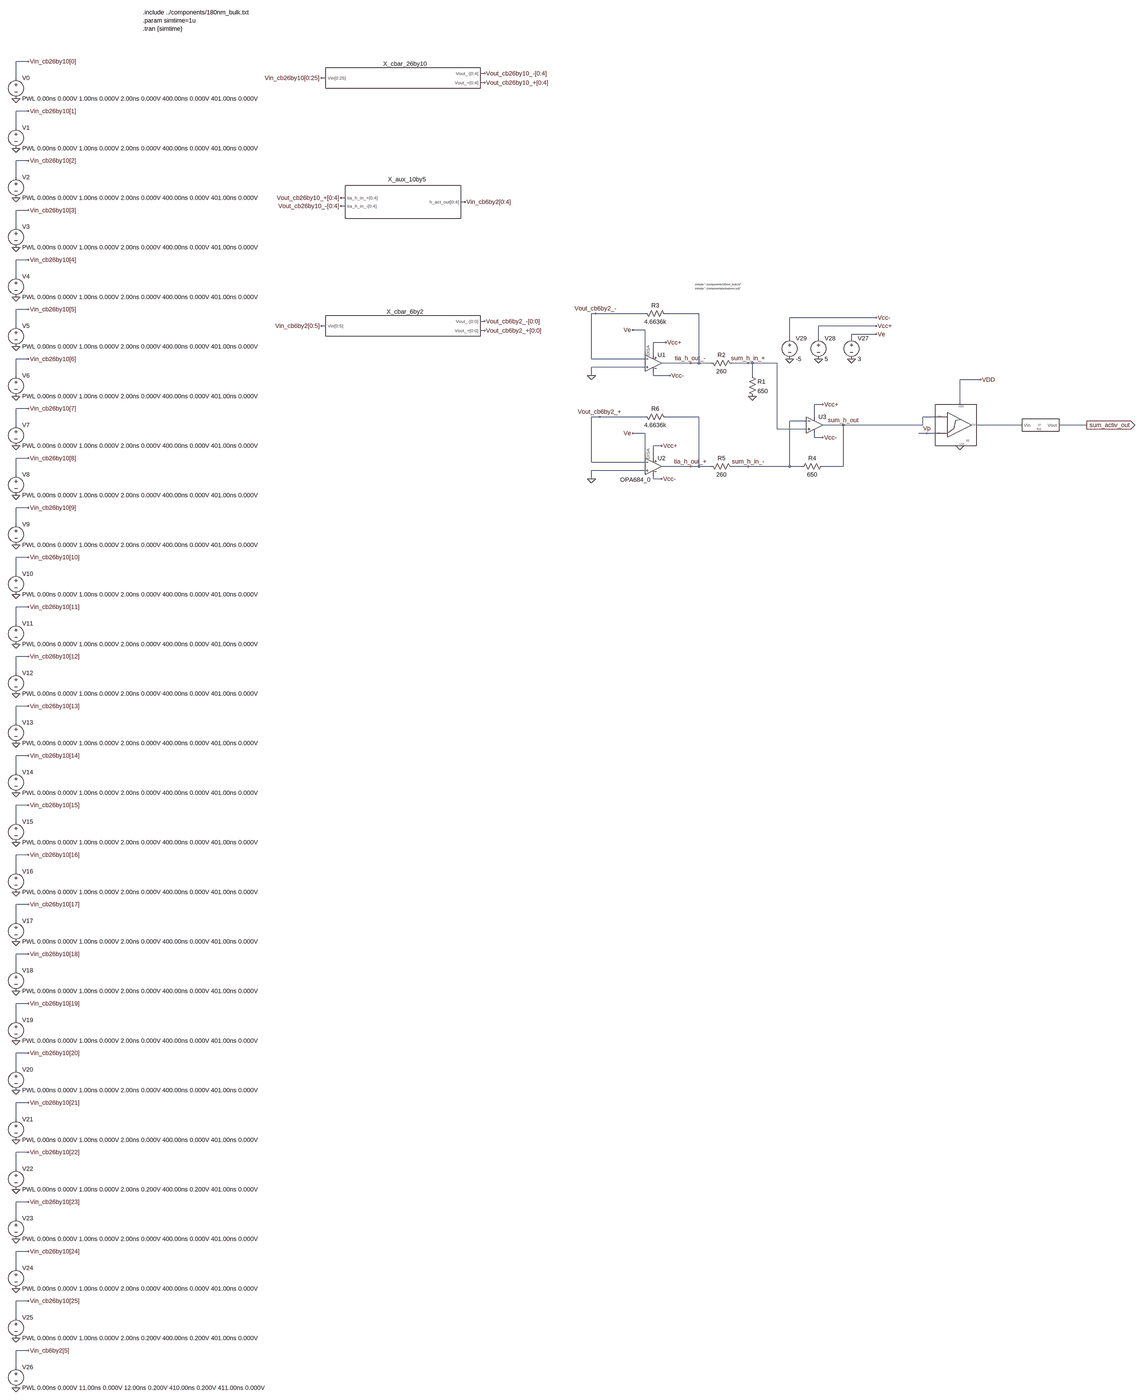
[diagram p0: schematic complete_circuit_generated.asc, whole sheet]
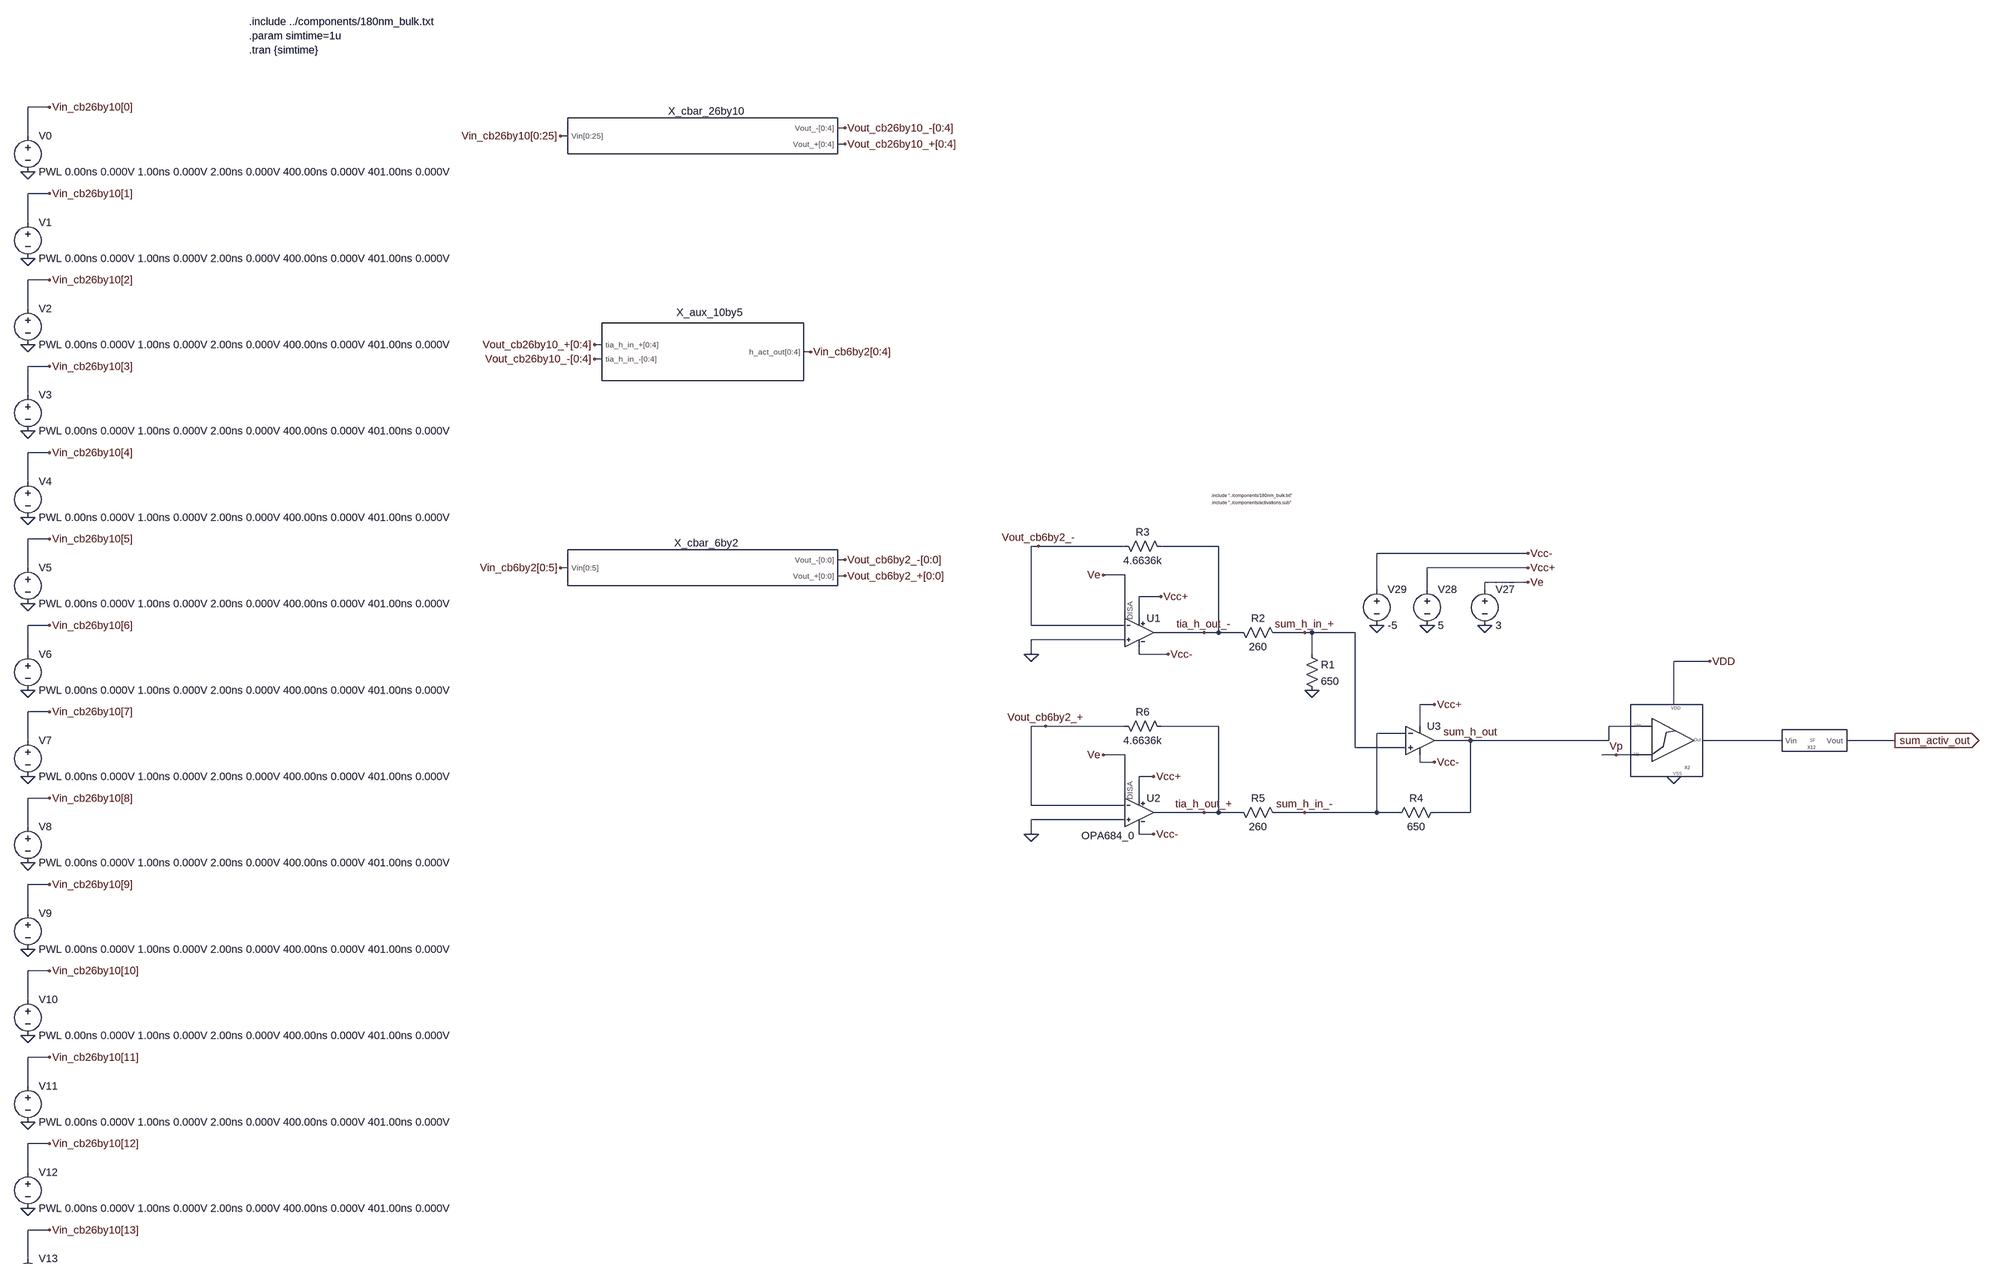
[diagram p1: schematic complete_circuit_generated.asc, part, row 1 of 2, column 1 of 1]
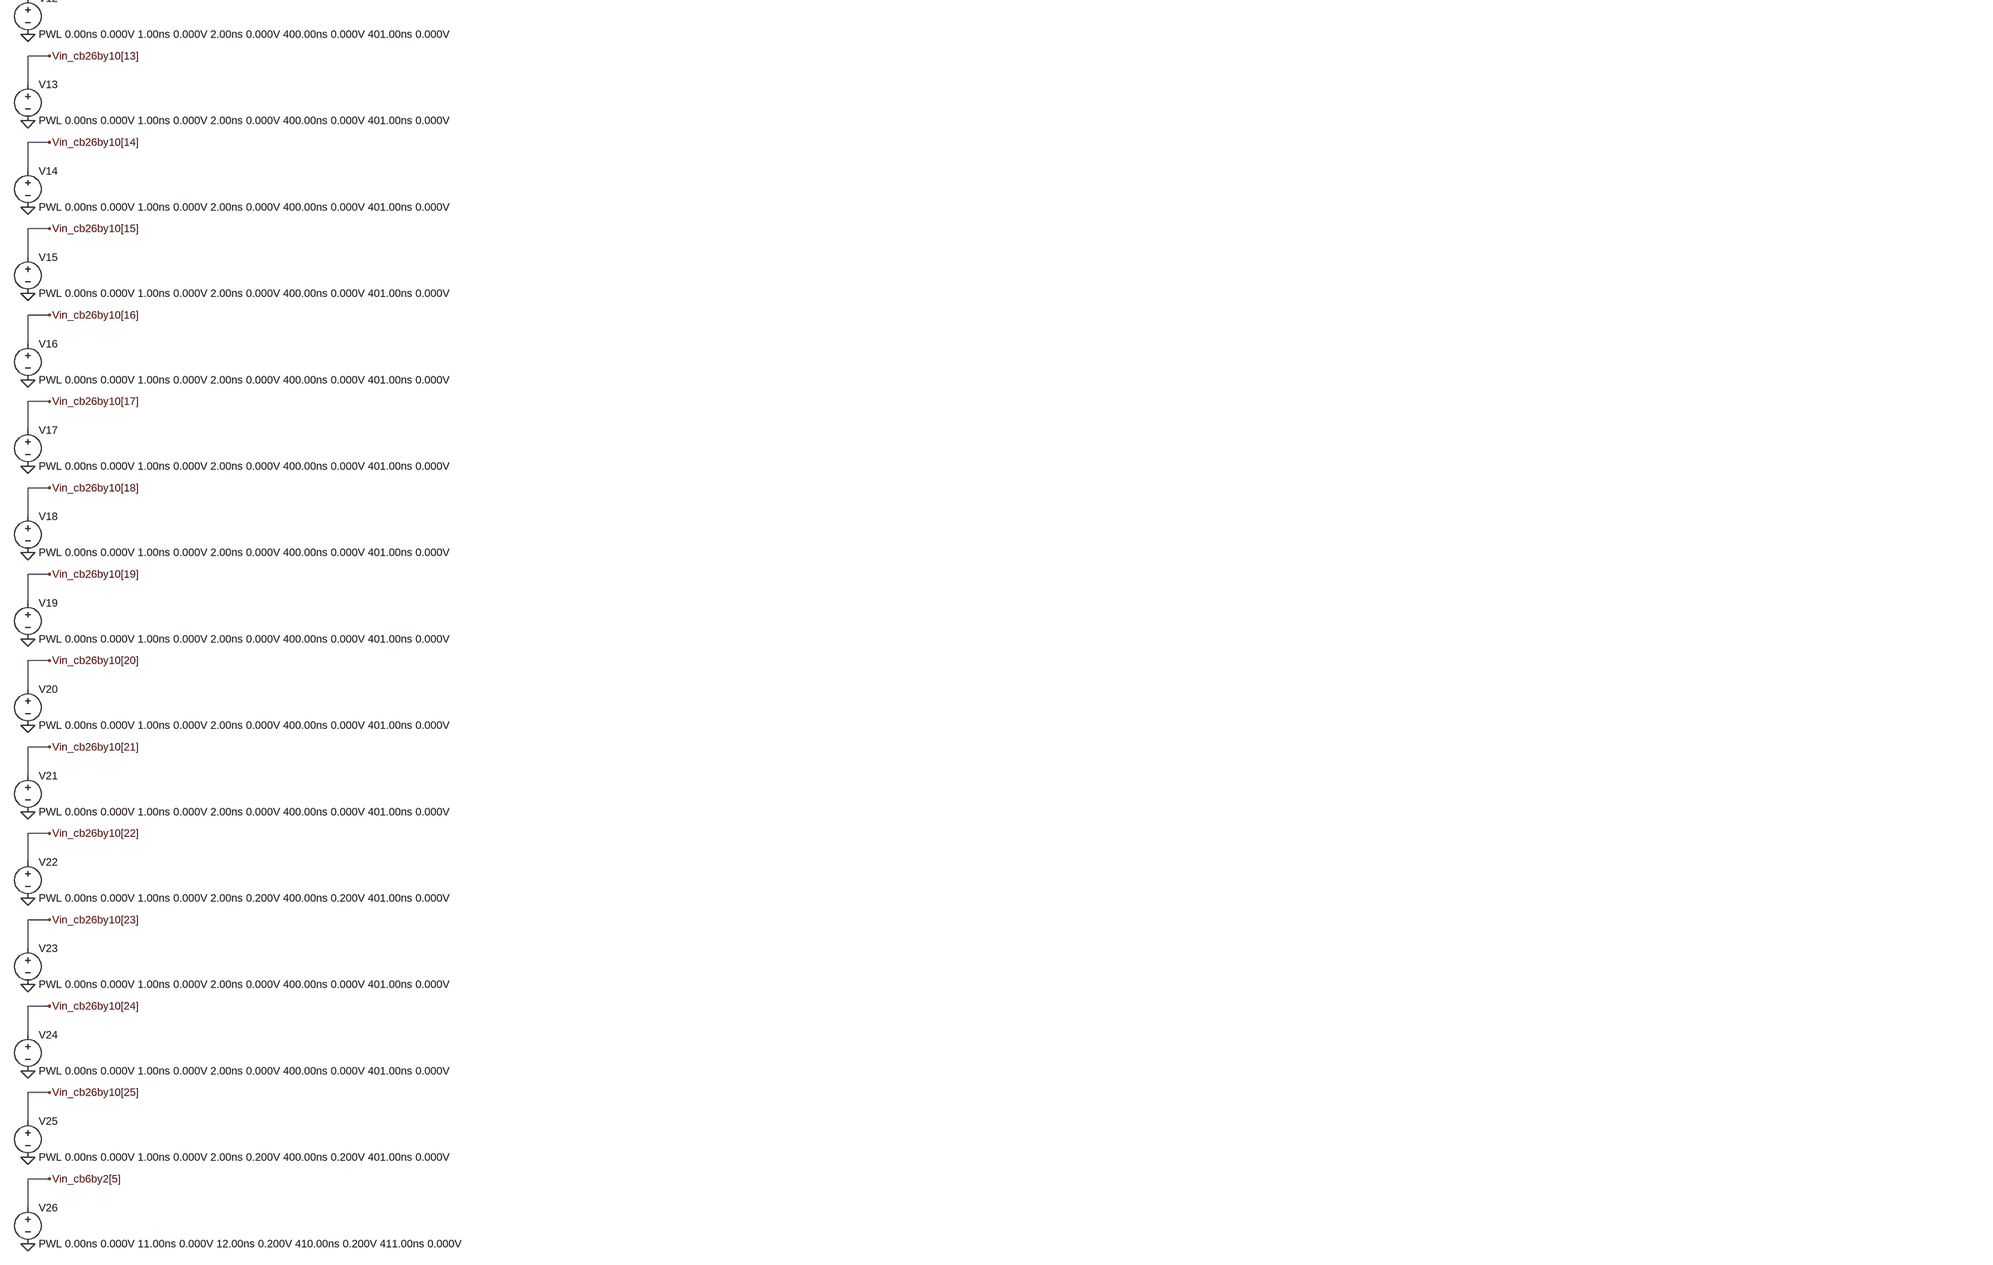
[diagram p2: schematic complete_circuit_generated.asc, part, row 2 of 2, column 1 of 1]
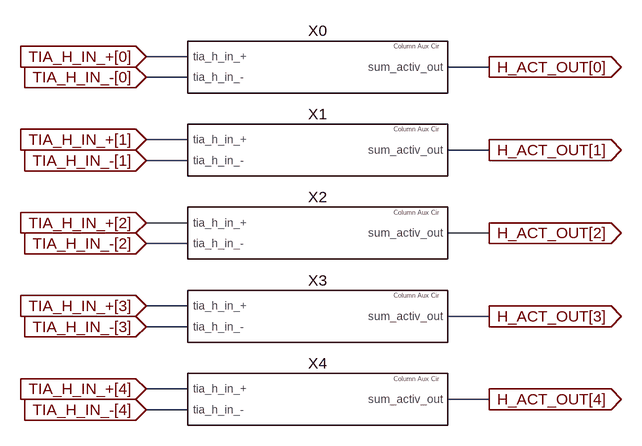
[diagram p3: sub-circuit x_aux_10by5.asc]
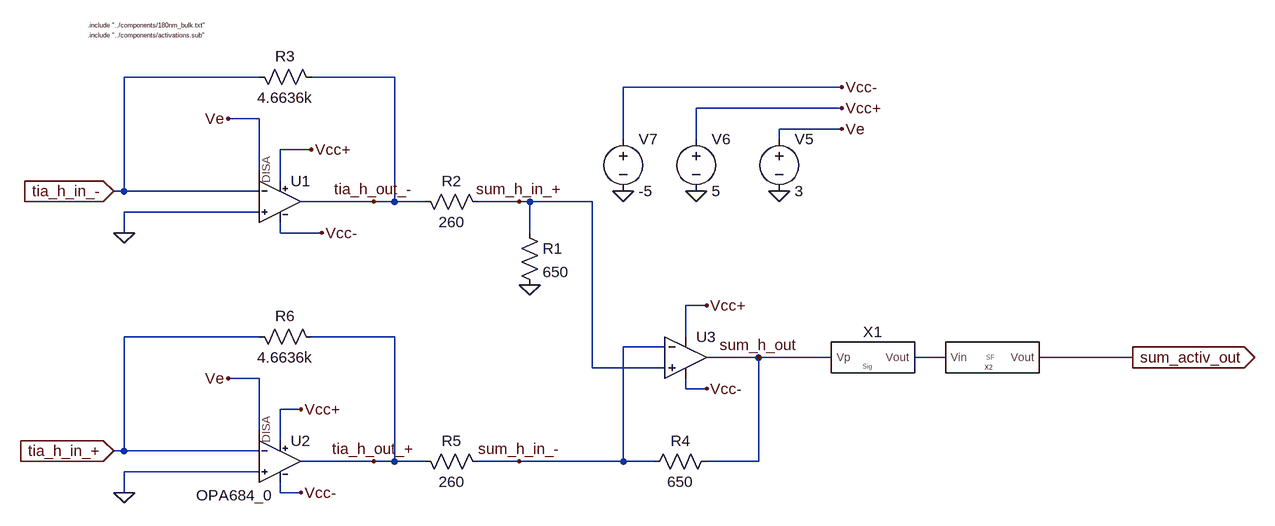
[diagram p4: sub-circuit column_activ_cmos.asc]
complete_circuit_generated.asc, the LTspice schematic file:
Version 4
SHEET 1 3496 5212
WIRE -1452 -48 -1500 -48
WIRE 316 -2 300 -2
WIRE -1500 16 -1500 -48
WIRE -300 16 -316 16
WIRE 316 34 300 34
WIRE -1452 144 -1500 144
WIRE -1500 208 -1500 144
WIRE -1452 336 -1500 336
WIRE -1500 400 -1500 336
WIRE -224 480 -240 480
WIRE 240 496 224 496
WIRE -224 512 -240 512
WIRE -1452 528 -1500 528
WIRE -1500 592 -1500 528
WIRE -1452 720 -1500 720
WIRE -1500 784 -1500 720
WIRE -1452 912 -1500 912
WIRE 1008 928 992 928
WIRE 1200 928 1008 928
WIRE 1408 928 1280 928
WIRE 2096 944 1760 944
WIRE 316 958 300 958
WIRE -1500 976 -1500 912
WIRE -300 976 -316 976
WIRE 2096 976 1872 976
WIRE 1200 992 1152 992
WIRE 316 994 300 994
WIRE 2096 1008 2000 1008
WIRE 1760 1024 1760 944
WIRE 1872 1024 1872 976
WIRE 2000 1024 2000 1008
WIRE 1280 1040 1232 1040
WIRE 1200 1072 1200 992
WIRE 1232 1088 1232 1040
WIRE -1452 1104 -1500 1104
WIRE 992 1104 992 928
WIRE 1200 1104 992 1104
WIRE 1376 1120 1264 1120
WIRE 1408 1120 1408 928
WIRE 1408 1120 1376 1120
WIRE 1456 1120 1408 1120
WIRE 1600 1120 1536 1120
WIRE 1616 1120 1600 1120
WIRE 1712 1120 1616 1120
WIRE 1200 1136 992 1136
WIRE -1500 1168 -1500 1104
WIRE 992 1168 992 1136
WIRE 1232 1168 1232 1152
WIRE 1296 1168 1232 1168
WIRE 1616 1168 1616 1120
WIRE 2640 1184 2560 1184
WIRE 1888 1280 1856 1280
WIRE 2560 1280 2560 1184
WIRE -1452 1296 -1500 1296
WIRE 1024 1328 992 1328
WIRE 1200 1328 1024 1328
WIRE 1408 1328 1280 1328
WIRE 1856 1328 1856 1280
WIRE 2464 1328 2416 1328
WIRE 1824 1344 1760 1344
WIRE -1500 1360 -1500 1296
WIRE 1968 1360 1888 1360
WIRE 2416 1360 2416 1328
WIRE 2416 1360 1968 1360
WIRE 2944 1360 2624 1360
WIRE 3248 1360 3088 1360
WIRE 1712 1376 1712 1120
WIRE 1824 1376 1712 1376
WIRE 1200 1392 1152 1392
WIRE 2432 1392 2400 1392
WIRE 2464 1392 2432 1392
WIRE 1856 1408 1856 1392
WIRE 1888 1408 1856 1408
WIRE 1264 1440 1232 1440
WIRE 1200 1472 1200 1392
WIRE -1452 1488 -1500 1488
WIRE 1232 1488 1232 1440
WIRE 992 1504 992 1328
WIRE 1200 1504 992 1504
WIRE 1376 1520 1264 1520
WIRE 1408 1520 1408 1328
WIRE 1408 1520 1376 1520
WIRE 1456 1520 1408 1520
WIRE 1600 1520 1536 1520
WIRE 1760 1520 1760 1344
WIRE 1760 1520 1600 1520
WIRE 1808 1520 1760 1520
WIRE 1968 1520 1968 1360
WIRE 1968 1520 1888 1520
WIRE 1200 1536 992 1536
WIRE -1500 1552 -1500 1488
WIRE 992 1568 992 1536
WIRE 1232 1568 1232 1552
WIRE 1264 1568 1232 1568
WIRE -1452 1680 -1500 1680
WIRE -1500 1744 -1500 1680
WIRE -1452 1872 -1500 1872
WIRE -1500 1936 -1500 1872
WIRE -1452 2064 -1500 2064
WIRE -1500 2128 -1500 2064
WIRE -1452 2256 -1500 2256
WIRE -1500 2320 -1500 2256
WIRE -1452 2448 -1500 2448
WIRE -1500 2512 -1500 2448
WIRE -1452 2640 -1500 2640
WIRE -1500 2704 -1500 2640
WIRE -1452 2832 -1500 2832
WIRE -1500 2896 -1500 2832
WIRE -1452 3024 -1500 3024
WIRE -1500 3088 -1500 3024
WIRE -1452 3216 -1500 3216
WIRE -1500 3280 -1500 3216
WIRE -1452 3408 -1500 3408
WIRE -1500 3472 -1500 3408
WIRE -1452 3600 -1500 3600
WIRE -1500 3664 -1500 3600
WIRE -1452 3792 -1500 3792
WIRE -1500 3856 -1500 3792
WIRE -1452 3984 -1500 3984
WIRE -1500 4048 -1500 3984
WIRE -1452 4176 -1500 4176
WIRE -1500 4240 -1500 4176
WIRE -1452 4368 -1500 4368
WIRE -1500 4432 -1500 4368
WIRE -1452 4560 -1500 4560
WIRE -1500 4624 -1500 4560
WIRE -1452 4752 -1500 4752
WIRE -1500 4816 -1500 4752
WIRE -1452 4944 -1500 4944
WIRE -1500 5008 -1500 4944
FLAG -316 16 Vin_cb26by10[0:25]
FLAG 316 34 Vout_cb26by10_+[0:4]
FLAG 316 -2 Vout_cb26by10_-[0:4]
FLAG -240 480 Vout_cb26by10_+[0:4]
FLAG -240 512 Vout_cb26by10_-[0:4]
FLAG 240 496 Vin_cb6by2[0:4]
FLAG -316 976 Vin_cb6by2[0:5]
FLAG 316 994 Vout_cb6by2_+[0:0]
FLAG 316 958 Vout_cb6by2_-[0:0]
FLAG -1500 96 0
FLAG -1452 -48 Vin_cb26by10[0]
FLAG -1500 288 0
FLAG -1452 144 Vin_cb26by10[1]
FLAG -1500 480 0
FLAG -1452 336 Vin_cb26by10[2]
FLAG -1500 672 0
FLAG -1452 528 Vin_cb26by10[3]
FLAG -1500 864 0
FLAG -1452 720 Vin_cb26by10[4]
FLAG -1500 1056 0
FLAG -1452 912 Vin_cb26by10[5]
FLAG -1500 1248 0
FLAG -1452 1104 Vin_cb26by10[6]
FLAG -1500 1440 0
FLAG -1452 1296 Vin_cb26by10[7]
FLAG -1500 1632 0
FLAG -1452 1488 Vin_cb26by10[8]
FLAG -1500 1824 0
FLAG -1452 1680 Vin_cb26by10[9]
FLAG -1500 2016 0
FLAG -1452 1872 Vin_cb26by10[10]
FLAG -1500 2208 0
FLAG -1452 2064 Vin_cb26by10[11]
FLAG -1500 2400 0
FLAG -1452 2256 Vin_cb26by10[12]
FLAG -1500 2592 0
FLAG -1452 2448 Vin_cb26by10[13]
FLAG -1500 2784 0
FLAG -1452 2640 Vin_cb26by10[14]
FLAG -1500 2976 0
FLAG -1452 2832 Vin_cb26by10[15]
FLAG -1500 3168 0
FLAG -1452 3024 Vin_cb26by10[16]
FLAG -1500 3360 0
FLAG -1452 3216 Vin_cb26by10[17]
FLAG -1500 3552 0
FLAG -1452 3408 Vin_cb26by10[18]
FLAG -1500 3744 0
FLAG -1452 3600 Vin_cb26by10[19]
FLAG -1500 3936 0
FLAG -1452 3792 Vin_cb26by10[20]
FLAG -1500 4128 0
FLAG -1452 3984 Vin_cb26by10[21]
FLAG -1500 4320 0
FLAG -1452 4176 Vin_cb26by10[22]
FLAG -1500 4512 0
FLAG -1452 4368 Vin_cb26by10[23]
FLAG -1500 4704 0
FLAG -1452 4560 Vin_cb26by10[24]
FLAG -1500 4896 0
FLAG -1452 4752 Vin_cb26by10[25]
FLAG -1500 5088 0
FLAG -1452 4944 Vin_cb6by2[5]
FLAG 992 1168 0
FLAG 1616 1248 0
FLAG 1600 1120 sum_h_in_+
FLAG 1376 1120 tia_h_out_-
FLAG 2000 1104 0
FLAG 1872 1104 0
FLAG 1760 1104 0
FLAG 2096 944 Vcc-
FLAG 2096 976 Vcc+
FLAG 2096 1008 Ve
FLAG 1280 1040 Vcc+
FLAG 1296 1168 Vcc-
FLAG 1152 992 Ve
FLAG 992 1568 0
FLAG 1600 1520 sum_h_in_-
FLAG 1376 1520 tia_h_out_+
FLAG 1264 1440 Vcc+
FLAG 1264 1568 Vcc-
FLAG 1152 1392 Ve
FLAG 1888 1408 Vcc-
FLAG 1888 1280 Vcc+
FLAG 1968 1360 sum_h_out
FLAG 3248 1360 sum_activ_out
IOPIN 3248 1360 Out
FLAG 1008 928 Vout_cb6by2_-
FLAG 1024 1328 Vout_cb6by2_+
FLAG 2560 1440 0
FLAG 2640 1184 VDD
FLAG 2432 1392 Vp
SYMBOL X_cbar_26by10 0 16 R0
SYMATTR InstName X_cbar_26by10
SYMBOL X_aux_10by5 0 496 R0
SYMATTR InstName X_aux_10by5
SYMBOL X_cbar_6by2 0 976 R0
SYMATTR InstName X_cbar_6by2
SYMBOL voltage -1500 0 R0
SYMATTR InstName V0
SYMATTR Value PWL 0.00ns 0.000V 1.00ns 0.000V 2.00ns 0.000V 400.00ns 0.000V 401.00ns 0.000V
SYMBOL voltage -1500 192 R0
SYMATTR InstName V1
SYMATTR Value PWL 0.00ns 0.000V 1.00ns 0.000V 2.00ns 0.000V 400.00ns 0.000V 401.00ns 0.000V
SYMBOL voltage -1500 384 R0
SYMATTR InstName V2
SYMATTR Value PWL 0.00ns 0.000V 1.00ns 0.000V 2.00ns 0.000V 400.00ns 0.000V 401.00ns 0.000V
SYMBOL voltage -1500 576 R0
SYMATTR InstName V3
SYMATTR Value PWL 0.00ns 0.000V 1.00ns 0.000V 2.00ns 0.000V 400.00ns 0.000V 401.00ns 0.000V
SYMBOL voltage -1500 768 R0
SYMATTR InstName V4
SYMATTR Value PWL 0.00ns 0.000V 1.00ns 0.000V 2.00ns 0.000V 400.00ns 0.000V 401.00ns 0.000V
SYMBOL voltage -1500 960 R0
SYMATTR InstName V5
SYMATTR Value PWL 0.00ns 0.000V 1.00ns 0.000V 2.00ns 0.000V 400.00ns 0.000V 401.00ns 0.000V
SYMBOL voltage -1500 1152 R0
SYMATTR InstName V6
SYMATTR Value PWL 0.00ns 0.000V 1.00ns 0.000V 2.00ns 0.000V 400.00ns 0.000V 401.00ns 0.000V
SYMBOL voltage -1500 1344 R0
SYMATTR InstName V7
SYMATTR Value PWL 0.00ns 0.000V 1.00ns 0.000V 2.00ns 0.000V 400.00ns 0.000V 401.00ns 0.000V
SYMBOL voltage -1500 1536 R0
SYMATTR InstName V8
SYMATTR Value PWL 0.00ns 0.000V 1.00ns 0.000V 2.00ns 0.000V 400.00ns 0.000V 401.00ns 0.000V
SYMBOL voltage -1500 1728 R0
SYMATTR InstName V9
SYMATTR Value PWL 0.00ns 0.000V 1.00ns 0.000V 2.00ns 0.000V 400.00ns 0.000V 401.00ns 0.000V
SYMBOL voltage -1500 1920 R0
SYMATTR InstName V10
SYMATTR Value PWL 0.00ns 0.000V 1.00ns 0.000V 2.00ns 0.000V 400.00ns 0.000V 401.00ns 0.000V
SYMBOL voltage -1500 2112 R0
SYMATTR InstName V11
SYMATTR Value PWL 0.00ns 0.000V 1.00ns 0.000V 2.00ns 0.000V 400.00ns 0.000V 401.00ns 0.000V
SYMBOL voltage -1500 2304 R0
SYMATTR InstName V12
SYMATTR Value PWL 0.00ns 0.000V 1.00ns 0.000V 2.00ns 0.000V 400.00ns 0.000V 401.00ns 0.000V
SYMBOL voltage -1500 2496 R0
SYMATTR InstName V13
SYMATTR Value PWL 0.00ns 0.000V 1.00ns 0.000V 2.00ns 0.000V 400.00ns 0.000V 401.00ns 0.000V
SYMBOL voltage -1500 2688 R0
SYMATTR InstName V14
SYMATTR Value PWL 0.00ns 0.000V 1.00ns 0.000V 2.00ns 0.000V 400.00ns 0.000V 401.00ns 0.000V
SYMBOL voltage -1500 2880 R0
SYMATTR InstName V15
SYMATTR Value PWL 0.00ns 0.000V 1.00ns 0.000V 2.00ns 0.000V 400.00ns 0.000V 401.00ns 0.000V
SYMBOL voltage -1500 3072 R0
SYMATTR InstName V16
SYMATTR Value PWL 0.00ns 0.000V 1.00ns 0.000V 2.00ns 0.000V 400.00ns 0.000V 401.00ns 0.000V
SYMBOL voltage -1500 3264 R0
SYMATTR InstName V17
SYMATTR Value PWL 0.00ns 0.000V 1.00ns 0.000V 2.00ns 0.000V 400.00ns 0.000V 401.00ns 0.000V
SYMBOL voltage -1500 3456 R0
SYMATTR InstName V18
SYMATTR Value PWL 0.00ns 0.000V 1.00ns 0.000V 2.00ns 0.000V 400.00ns 0.000V 401.00ns 0.000V
SYMBOL voltage -1500 3648 R0
SYMATTR InstName V19
SYMATTR Value PWL 0.00ns 0.000V 1.00ns 0.000V 2.00ns 0.000V 400.00ns 0.000V 401.00ns 0.000V
SYMBOL voltage -1500 3840 R0
SYMATTR InstName V20
SYMATTR Value PWL 0.00ns 0.000V 1.00ns 0.000V 2.00ns 0.000V 400.00ns 0.000V 401.00ns 0.000V
SYMBOL voltage -1500 4032 R0
SYMATTR InstName V21
SYMATTR Value PWL 0.00ns 0.000V 1.00ns 0.000V 2.00ns 0.000V 400.00ns 0.000V 401.00ns 0.000V
SYMBOL voltage -1500 4224 R0
SYMATTR InstName V22
SYMATTR Value PWL 0.00ns 0.000V 1.00ns 0.000V 2.00ns 0.200V 400.00ns 0.200V 401.00ns 0.000V
SYMBOL voltage -1500 4416 R0
SYMATTR InstName V23
SYMATTR Value PWL 0.00ns 0.000V 1.00ns 0.000V 2.00ns 0.000V 400.00ns 0.000V 401.00ns 0.000V
SYMBOL voltage -1500 4608 R0
SYMATTR InstName V24
SYMATTR Value PWL 0.00ns 0.000V 1.00ns 0.000V 2.00ns 0.000V 400.00ns 0.000V 401.00ns 0.000V
SYMBOL voltage -1500 4800 R0
SYMATTR InstName V25
SYMATTR Value PWL 0.00ns 0.000V 1.00ns 0.000V 2.00ns 0.200V 400.00ns 0.200V 401.00ns 0.000V
SYMBOL voltage -1500 4992 R0
SYMATTR InstName V26
SYMATTR Value PWL 0.00ns 0.000V 11.00ns 0.000V 12.00ns 0.200V 410.00ns 0.200V 411.00ns 0.000V
SYMBOL res 1600 1152 R0
SYMATTR InstName R1
SYMATTR Value 650
SYMBOL res 1552 1136 M270
WINDOW 0 32 56 VTop 2
WINDOW 3 0 56 VBottom 2
SYMATTR InstName R2
SYMATTR Value 260
SYMBOL res 1296 944 M270
WINDOW 0 32 56 VTop 2
WINDOW 3 0 56 VBottom 2
SYMATTR InstName R3
SYMATTR Value 4.6636k
SYMBOL MySym\\opamp2_custom 1232 1056 R0
WINDOW 3 16 96 Invisible 2
SYMATTR Value ""
SYMATTR InstName U1
SYMATTR SpiceModel OPA684_0
SYMBOL voltage 2000 1008 R0
WINDOW 123 0 0 Left 0
WINDOW 39 0 0 Left 0
SYMATTR InstName V27
SYMATTR Value 3
SYMBOL voltage 1872 1008 R0
WINDOW 123 0 0 Left 0
WINDOW 39 0 0 Left 0
SYMATTR InstName V28
SYMATTR Value 5
SYMBOL voltage 1760 1008 R0
WINDOW 123 0 0 Left 0
WINDOW 39 0 0 Left 0
SYMATTR InstName V29
SYMATTR Value -5
SYMBOL res 1904 1504 R90
WINDOW 0 0 56 VBottom 2
WINDOW 3 32 56 VTop 2
SYMATTR InstName R4
SYMATTR Value 650
SYMBOL res 1552 1536 M270
WINDOW 0 32 56 VTop 2
WINDOW 3 0 56 VBottom 2
SYMATTR InstName R5
SYMATTR Value 260
SYMBOL res 1296 1344 M270
WINDOW 0 32 56 VTop 2
WINDOW 3 0 56 VBottom 2
SYMATTR InstName R6
SYMATTR Value 4.6636k
SYMBOL MySym\\opamp2_custom 1232 1456 R0
WINDOW 3 16 96 Invisible 2
WINDOW 38 -129 116 Left 2
SYMATTR Value ""
SYMATTR SpiceModel OPA684_0
SYMATTR InstName U2
SYMBOL OpAmps\\opamp2 1856 1296 R0
WINDOW 3 16 96 Invisible 2
SYMATTR Value ""
SYMATTR InstName U3
SYMATTR SpiceModel MAX4223
SYMBOL comparator 2544 1360 R0
SYMATTR InstName X2
SYMBOL MySym\\sourceFollower 3008 1360 R0
SYMATTR InstName X12
TEXT -1008 -208 Left 2 !.tran {simtime}
TEXT -1008 -240 Left 2 !.param simtime=1u
TEXT -1008 -272 Left 2 !.include ../components/180nm_bulk.txt
TEXT 1392 832 Left 0 !.include "../components/activations.sub"
TEXT 1392 816 Left 0 !.include "../components/180nm_bulk.txt"

x_aux_10by5.asc, the sub-circuit schematic file:
Version 4 
SHEET 1 880 680
WIRE 48 80 -16 80
WIRE 48 112 -16 112
WIRE 512 96 448 96
WIRE 48 208 -16 208
WIRE 48 240 -16 240
WIRE 512 224 448 224
WIRE 48 336 -16 336
WIRE 48 368 -16 368
WIRE 512 352 448 352
WIRE 48 464 -16 464
WIRE 48 496 -16 496
WIRE 512 480 448 480
WIRE 48 592 -16 592
WIRE 48 624 -16 624
WIRE 512 608 448 608
FLAG -16 80 TIA_H_IN_+[0]
IOPIN -16 80 IN
FLAG -16 112 TIA_H_IN_-[0]
IOPIN -16 112 IN
FLAG 512 96 H_ACT_OUT[0]
IOPIN 512 96 OUT
FLAG -16 208 TIA_H_IN_+[1]
IOPIN -16 208 IN
FLAG -16 240 TIA_H_IN_-[1]
IOPIN -16 240 IN
FLAG 512 224 H_ACT_OUT[1]
IOPIN 512 224 OUT
FLAG -16 336 TIA_H_IN_+[2]
IOPIN -16 336 IN
FLAG -16 368 TIA_H_IN_-[2]
IOPIN -16 368 IN
FLAG 512 352 H_ACT_OUT[2]
IOPIN 512 352 OUT
FLAG -16 464 TIA_H_IN_+[3]
IOPIN -16 464 IN
FLAG -16 496 TIA_H_IN_-[3]
IOPIN -16 496 IN
FLAG 512 480 H_ACT_OUT[3]
IOPIN 512 480 OUT
FLAG -16 592 TIA_H_IN_+[4]
IOPIN -16 592 IN
FLAG -16 624 TIA_H_IN_-[4]
IOPIN -16 624 IN
FLAG 512 608 H_ACT_OUT[4]
IOPIN 512 608 OUT
SYMBOL column_activ_cmos 240 96 R0
SYMATTR InstName X0
SYMBOL column_activ_cmos 240 224 R0
SYMATTR InstName X1
SYMBOL column_activ_cmos 240 352 R0
SYMATTR InstName X2
SYMBOL column_activ_cmos 240 480 R0
SYMATTR InstName X3
SYMBOL column_activ_cmos 240 608 R0
SYMATTR InstName X4

column_activ_cmos.asc, the sub-circuit schematic file:
Version 4
SHEET 1 2360 680
WIRE 160 -128 -48 -128
WIRE 368 -128 240 -128
WIRE 1056 -112 720 -112
WIRE 1056 -80 832 -80
WIRE 160 -64 112 -64
WIRE 1056 -48 960 -48
WIRE 720 -32 720 -112
WIRE 832 -32 832 -80
WIRE 960 -32 960 -48
WIRE 240 -16 192 -16
WIRE 160 16 160 -64
WIRE 192 32 192 -16
WIRE -48 48 -48 -128
WIRE -48 48 -64 48
WIRE 160 48 -48 48
WIRE 336 64 224 64
WIRE 368 64 368 -128
WIRE 368 64 336 64
WIRE 416 64 368 64
WIRE 560 64 496 64
WIRE 576 64 560 64
WIRE 672 64 576 64
WIRE 160 80 -48 80
WIRE -48 112 -48 80
WIRE 192 112 192 96
WIRE 256 112 192 112
WIRE 576 112 576 64
WIRE 848 224 816 224
WIRE 160 272 -48 272
WIRE 368 272 240 272
WIRE 816 272 816 224
WIRE 784 288 720 288
WIRE 928 304 848 304
WIRE 1040 304 928 304
WIRE 1216 304 1168 304
WIRE 1504 304 1360 304
WIRE 672 320 672 64
WIRE 784 320 672 320
WIRE 160 336 112 336
WIRE 816 352 816 336
WIRE 848 352 816 352
WIRE 224 384 192 384
WIRE 160 416 160 336
WIRE 192 432 192 384
WIRE -48 448 -48 272
WIRE -48 448 -64 448
WIRE 160 448 -48 448
WIRE 336 464 224 464
WIRE 368 464 368 272
WIRE 368 464 336 464
WIRE 416 464 368 464
WIRE 560 464 496 464
WIRE 720 464 720 288
WIRE 720 464 560 464
WIRE 768 464 720 464
WIRE 928 464 928 304
WIRE 928 464 848 464
WIRE 160 480 -48 480
WIRE -48 512 -48 480
WIRE 192 512 192 496
WIRE 224 512 192 512
FLAG -48 112 0
FLAG 576 192 0
FLAG 560 64 sum_h_in_+
FLAG 336 64 tia_h_out_-
FLAG 960 48 0
FLAG 832 48 0
FLAG 720 48 0
FLAG 1056 -112 Vcc-
FLAG 1056 -80 Vcc+
FLAG 1056 -48 Ve
FLAG 240 -16 Vcc+
FLAG 256 112 Vcc-
FLAG 112 -64 Ve
FLAG -48 512 0
FLAG 560 464 sum_h_in_-
FLAG 336 464 tia_h_out_+
FLAG 224 384 Vcc+
FLAG 224 512 Vcc-
FLAG 112 336 Ve
FLAG 848 352 Vcc-
FLAG 848 224 Vcc+
FLAG 928 304 sum_h_out
FLAG -64 448 tia_h_in_+
IOPIN -64 448 In
FLAG -64 48 tia_h_in_-
IOPIN -64 48 In
FLAG 1504 304 sum_activ_out
IOPIN 1504 304 Out
SYMBOL res 560 96 R0
SYMATTR InstName R1
SYMATTR Value 650
SYMBOL res 512 80 M270
WINDOW 0 32 56 VTop 2
WINDOW 3 0 56 VBottom 2
SYMATTR InstName R2
SYMATTR Value 260
SYMBOL res 256 -112 M270
WINDOW 0 32 56 VTop 2
WINDOW 3 0 56 VBottom 2
SYMATTR InstName R3
SYMATTR Value 4.6636k
SYMBOL MySym\\opamp2_custom 192 0 R0
WINDOW 3 16 96 Invisible 2
SYMATTR Value ""
SYMATTR InstName U1
SYMATTR SpiceModel OPA684_0
SYMBOL voltage 960 -48 R0
WINDOW 123 0 0 Left 0
WINDOW 39 0 0 Left 0
SYMATTR InstName V5
SYMATTR Value 3
SYMBOL voltage 832 -48 R0
WINDOW 123 0 0 Left 0
WINDOW 39 0 0 Left 0
SYMATTR InstName V6
SYMATTR Value 5
SYMBOL voltage 720 -48 R0
WINDOW 123 0 0 Left 0
WINDOW 39 0 0 Left 0
SYMATTR InstName V7
SYMATTR Value -5
SYMBOL res 864 448 R90
WINDOW 0 0 56 VBottom 2
WINDOW 3 32 56 VTop 2
SYMATTR InstName R4
SYMATTR Value 650
SYMBOL res 512 480 M270
WINDOW 0 32 56 VTop 2
WINDOW 3 0 56 VBottom 2
SYMATTR InstName R5
SYMATTR Value 260
SYMBOL res 256 288 M270
WINDOW 0 32 56 VTop 2
WINDOW 3 0 56 VBottom 2
SYMATTR InstName R6
SYMATTR Value 4.6636k
SYMBOL MySym\\opamp2_custom 192 400 R0
WINDOW 3 16 96 Invisible 2
WINDOW 38 -129 116 Left 2
SYMATTR Value ""
SYMATTR SpiceModel OPA684_0
SYMATTR InstName U2
SYMBOL OpAmps\\opamp2 816 240 R0
WINDOW 3 16 96 Invisible 2
SYMATTR Value ""
SYMATTR InstName U3
SYMATTR SpiceModel MAX4223
SYMBOL MySym\\RNN_Sigmoid3_HA 1104 304 R0
SYMATTR InstName X1
SYMBOL MySym\\sourceFollower 1280 304 R0
SYMATTR InstName X2
TEXT -104 -192 Left 0 !.include "../components/activations.sub"
TEXT -104 -208 Left 0 !.include "../components/180nm_bulk.txt"

The netlist it stands for:
* complete_circuit_generated.asc
XX_cbar_26by10 Vin_cb26by10[0] Vin_cb26by10[1] Vin_cb26by10[2] Vin_cb26by10[3] Vin_cb26by10[4] Vin_cb26by10[5] Vin_cb26by10[6] Vin_cb26by10[7] Vin_cb26by10[8] Vin_cb26by10[9] Vin_cb26by10[10] Vin_cb26by10[11] Vin_cb26by10[12] Vin_cb26by10[13] Vin_cb26by10[14] Vin_cb26by10[15] Vin_cb26by10[16] Vin_cb26by10[17] Vin_cb26by10[18] Vin_cb26by10[19] Vin_cb26by10[20] Vin_cb26by10[21] Vin_cb26by10[22] Vin_cb26by10[23] Vin_cb26by10[24] Vin_cb26by10[25] Vout_cb26by10_+[0] Vout_cb26by10_+[1] Vout_cb26by10_+[2] Vout_cb26by10_+[3] Vout_cb26by10_+[4] Vout_cb26by10_-[0] Vout_cb26by10_-[1] Vout_cb26by10_-[2] Vout_cb26by10_-[3] Vout_cb26by10_-[4] X_cbar_26by10  ; pins Vin[0:25] Vout_+[0:4] Vout_-[0:4]
XX_aux_10by5 Vout_cb26by10_+[0] Vout_cb26by10_+[1] Vout_cb26by10_+[2] Vout_cb26by10_+[3] Vout_cb26by10_+[4] Vout_cb26by10_-[0] Vout_cb26by10_-[1] Vout_cb26by10_-[2] Vout_cb26by10_-[3] Vout_cb26by10_-[4] Vin_cb6by2[0] Vin_cb6by2[1] Vin_cb6by2[2] Vin_cb6by2[3] Vin_cb6by2[4] x_aux_10by5
XX_cbar_6by2 Vin_cb6by2[0] Vin_cb6by2[1] Vin_cb6by2[2] Vin_cb6by2[3] Vin_cb6by2[4] Vin_cb6by2[5] Vout_cb6by2_+[0:0] Vout_cb6by2_-[0:0] X_cbar_6by2  ; pins Vin[0:5] Vout_+[0:0] Vout_-[0:0]
V0 Vin_cb26by10[0] 0 PWL 0.00ns 0.000V 1.00ns 0.000V 2.00ns 0.000V 400.00ns 0.000V 401.00ns 0.000V
V1 Vin_cb26by10[1] 0 PWL 0.00ns 0.000V 1.00ns 0.000V 2.00ns 0.000V 400.00ns 0.000V 401.00ns 0.000V
V2 Vin_cb26by10[2] 0 PWL 0.00ns 0.000V 1.00ns 0.000V 2.00ns 0.000V 400.00ns 0.000V 401.00ns 0.000V
V3 Vin_cb26by10[3] 0 PWL 0.00ns 0.000V 1.00ns 0.000V 2.00ns 0.000V 400.00ns 0.000V 401.00ns 0.000V
V4 Vin_cb26by10[4] 0 PWL 0.00ns 0.000V 1.00ns 0.000V 2.00ns 0.000V 400.00ns 0.000V 401.00ns 0.000V
V5 Vin_cb26by10[5] 0 PWL 0.00ns 0.000V 1.00ns 0.000V 2.00ns 0.000V 400.00ns 0.000V 401.00ns 0.000V
V6 Vin_cb26by10[6] 0 PWL 0.00ns 0.000V 1.00ns 0.000V 2.00ns 0.000V 400.00ns 0.000V 401.00ns 0.000V
V7 Vin_cb26by10[7] 0 PWL 0.00ns 0.000V 1.00ns 0.000V 2.00ns 0.000V 400.00ns 0.000V 401.00ns 0.000V
V8 Vin_cb26by10[8] 0 PWL 0.00ns 0.000V 1.00ns 0.000V 2.00ns 0.000V 400.00ns 0.000V 401.00ns 0.000V
V9 Vin_cb26by10[9] 0 PWL 0.00ns 0.000V 1.00ns 0.000V 2.00ns 0.000V 400.00ns 0.000V 401.00ns 0.000V
V10 Vin_cb26by10[10] 0 PWL 0.00ns 0.000V 1.00ns 0.000V 2.00ns 0.000V 400.00ns 0.000V 401.00ns 0.000V
V11 Vin_cb26by10[11] 0 PWL 0.00ns 0.000V 1.00ns 0.000V 2.00ns 0.000V 400.00ns 0.000V 401.00ns 0.000V
V12 Vin_cb26by10[12] 0 PWL 0.00ns 0.000V 1.00ns 0.000V 2.00ns 0.000V 400.00ns 0.000V 401.00ns 0.000V
V13 Vin_cb26by10[13] 0 PWL 0.00ns 0.000V 1.00ns 0.000V 2.00ns 0.000V 400.00ns 0.000V 401.00ns 0.000V
V14 Vin_cb26by10[14] 0 PWL 0.00ns 0.000V 1.00ns 0.000V 2.00ns 0.000V 400.00ns 0.000V 401.00ns 0.000V
V15 Vin_cb26by10[15] 0 PWL 0.00ns 0.000V 1.00ns 0.000V 2.00ns 0.000V 400.00ns 0.000V 401.00ns 0.000V
V16 Vin_cb26by10[16] 0 PWL 0.00ns 0.000V 1.00ns 0.000V 2.00ns 0.000V 400.00ns 0.000V 401.00ns 0.000V
V17 Vin_cb26by10[17] 0 PWL 0.00ns 0.000V 1.00ns 0.000V 2.00ns 0.000V 400.00ns 0.000V 401.00ns 0.000V
V18 Vin_cb26by10[18] 0 PWL 0.00ns 0.000V 1.00ns 0.000V 2.00ns 0.000V 400.00ns 0.000V 401.00ns 0.000V
V19 Vin_cb26by10[19] 0 PWL 0.00ns 0.000V 1.00ns 0.000V 2.00ns 0.000V 400.00ns 0.000V 401.00ns 0.000V
V20 Vin_cb26by10[20] 0 PWL 0.00ns 0.000V 1.00ns 0.000V 2.00ns 0.000V 400.00ns 0.000V 401.00ns 0.000V
V21 Vin_cb26by10[21] 0 PWL 0.00ns 0.000V 1.00ns 0.000V 2.00ns 0.000V 400.00ns 0.000V 401.00ns 0.000V
V22 Vin_cb26by10[22] 0 PWL 0.00ns 0.000V 1.00ns 0.000V 2.00ns 0.200V 400.00ns 0.200V 401.00ns 0.000V
V23 Vin_cb26by10[23] 0 PWL 0.00ns 0.000V 1.00ns 0.000V 2.00ns 0.000V 400.00ns 0.000V 401.00ns 0.000V
V24 Vin_cb26by10[24] 0 PWL 0.00ns 0.000V 1.00ns 0.000V 2.00ns 0.000V 400.00ns 0.000V 401.00ns 0.000V
V25 Vin_cb26by10[25] 0 PWL 0.00ns 0.000V 1.00ns 0.000V 2.00ns 0.200V 400.00ns 0.200V 401.00ns 0.000V
V26 Vin_cb6by2[5] 0 PWL 0.00ns 0.000V 11.00ns 0.000V 12.00ns 0.200V 410.00ns 0.200V 411.00ns 0.000V
R1 sum_h_in_+ 0 650
R2 sum_h_in_+ tia_h_out_- 260
R3 tia_h_out_- Vout_cb6by2_- 4.6636k
XU1 0 Vout_cb6by2_- Vcc+ Vcc- tia_h_out_- Ve OPA684_0  ; pins In+ In- V+ V- OUT DISA
V27 Ve 0 3
V28 Vcc+ 0 5
V29 Vcc- 0 -5
R4 sum_h_out sum_h_in_- 650
R5 sum_h_in_- tia_h_out_+ 260
R6 tia_h_out_+ Vout_cb6by2_+ 4.6636k
XU2 0 Vout_cb6by2_+ Vcc+ Vcc- tia_h_out_+ Ve OPA684_0  ; pins In+ In- V+ V- OUT DISA
XU3 sum_h_in_+ sum_h_in_- Vcc+ Vcc- sum_h_out MAX4223  ; pins In+ In- V+ V- OUT
XX2 sum_h_out Vp VDD 0 N001 comparator  ; pins Vm Vp VDD VSS Out
XX12 N001 sum_activ_out sourceFollower  ; pins Vin Vout

* block symbol definitions
.subckt x_aux_10by5 tia_h_in_+[0] tia_h_in_+[1] tia_h_in_+[2] tia_h_in_+[3] tia_h_in_+[4] tia_h_in_-[0] tia_h_in_-[1] tia_h_in_-[2] tia_h_in_-[3] tia_h_in_-[4] h_act_out[0] h_act_out[1] h_act_out[2] h_act_out[3] h_act_out[4]
XX0 TIA_H_IN_+[0] TIA_H_IN_-[0] H_ACT_OUT[0] column_activ_cmos
XX1 TIA_H_IN_+[1] TIA_H_IN_-[1] H_ACT_OUT[1] column_activ_cmos
XX2 TIA_H_IN_+[2] TIA_H_IN_-[2] H_ACT_OUT[2] column_activ_cmos
XX3 TIA_H_IN_+[3] TIA_H_IN_-[3] H_ACT_OUT[3] column_activ_cmos
XX4 TIA_H_IN_+[4] TIA_H_IN_-[4] H_ACT_OUT[4] column_activ_cmos
.ends x_aux_10by5

.subckt column_activ_cmos tia_h_in_+ tia_h_in_- sum_activ_out
R1 sum_h_in_+ 0 650
R2 sum_h_in_+ tia_h_out_- 260
R3 tia_h_out_- tia_h_in_- 4.6636k
XU1 0 tia_h_in_- Vcc+ Vcc- tia_h_out_- Ve OPA684_0  ; pins In+ In- V+ V- OUT DISA
V5 Ve 0 3
V6 Vcc+ 0 5
V7 Vcc- 0 -5
R4 sum_h_out sum_h_in_- 650
R5 sum_h_in_- tia_h_out_+ 260
R6 tia_h_out_+ tia_h_in_+ 4.6636k
XU2 0 tia_h_in_+ Vcc+ Vcc- tia_h_out_+ Ve OPA684_0  ; pins In+ In- V+ V- OUT DISA
XU3 sum_h_in_+ sum_h_in_- Vcc+ Vcc- sum_h_out MAX4223  ; pins In+ In- V+ V- OUT
XX1 sum_h_out N001 RNN_Sigmoid3_HA  ; pins Vp Vout
XX2 N001 sum_activ_out sourceFollower  ; pins Vin Vout
.include "../components/activations.sub"
.include "../components/180nm_bulk.txt"
.ends column_activ_cmos

.tran {simtime}
.param simtime=1u
.include ../components/180nm_bulk.txt
.include "../components/activations.sub"
.include "../components/180nm_bulk.txt"
.backanno
.end